# EAGLE design ESRMeterN (EAGLE 6.6.0)
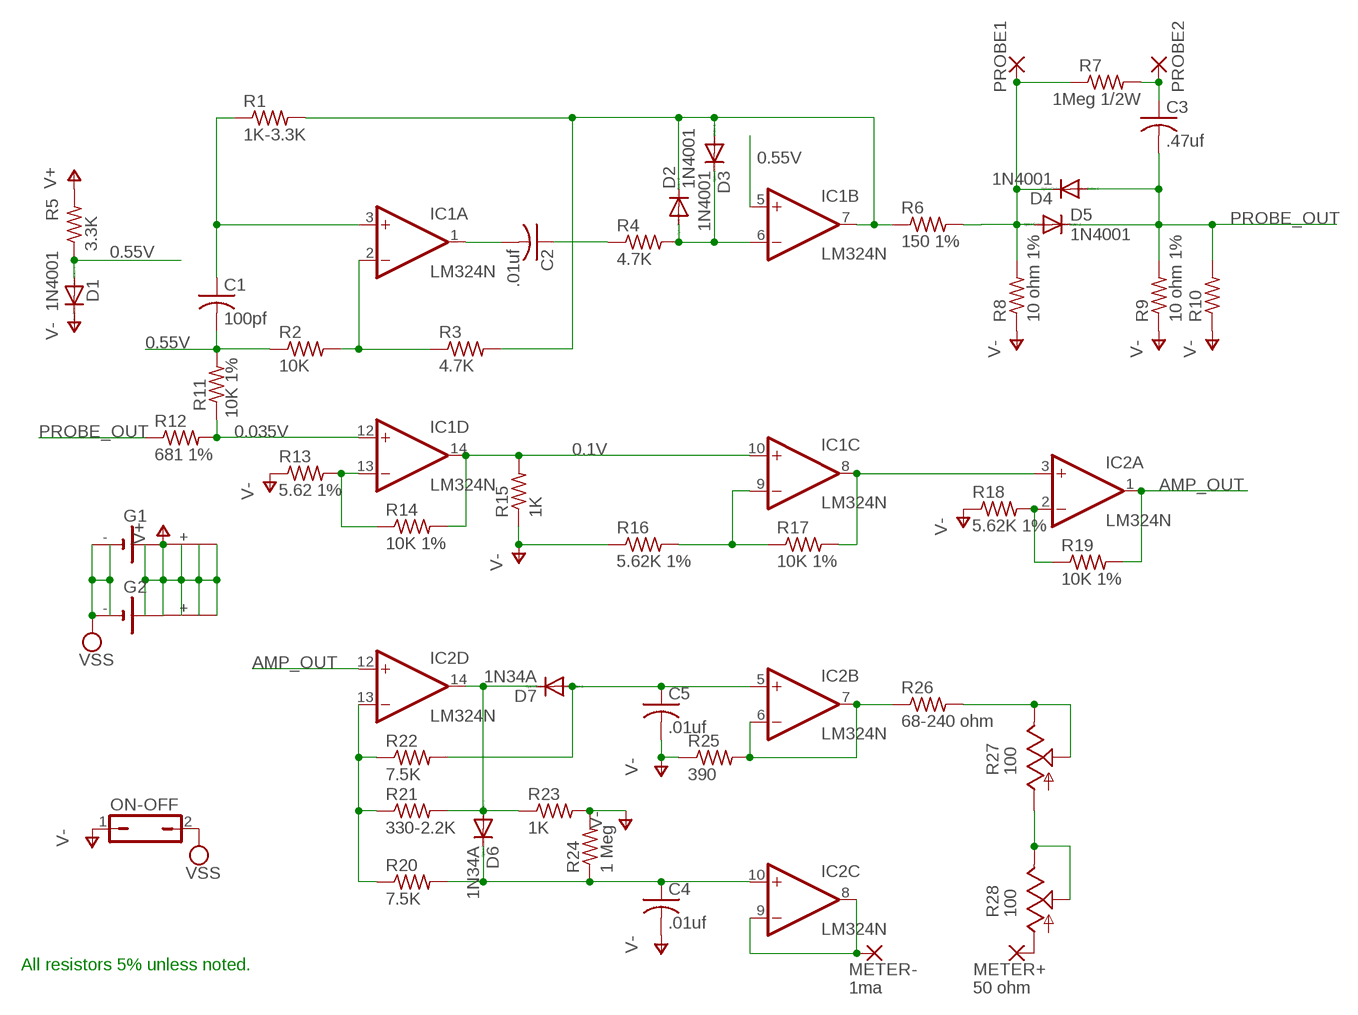
[diagram p0: schematic, sheet 1]

## Parts
C1  100pf  C-US050-025X075  [C050-025X075]
C2  .01uf  C-US050-025X075  [C050-025X075]
C3  .47uf  C-US075-032X103  [C075-032X103]
C4  .01uf  C-US050-025X075  [C050-025X075]
C5  .01uf  C-US050-025X075  [C050-025X075]
D1  1N4001  1N4004  [DO41-10]
D2  1N4001  1N4004  [DO41-10]
D3  1N4001  1N4004  [DO41-10]
D4  1N4001  1N4004  [DO41-10]
D5  1N4001  1N4004  [DO41-10]
D6  1N34A  1N4004  [DO41-10]
D7  1N34A  1N4004  [DO41-10]
G1  B2430UNI  [B2430UNI]
G2  B2430UNI  [B2430UNI]
IC1  LM324N  [DIL14]
IC2  LM324N  [DIL14]
METER+  50 ohm  2,15/1,0  [2,15/1,0]
METER-  1ma  2,15/1,0  [2,15/1,0]
ON-OFF  JP1Q  [JP1]
PROBE1  2,15/1,0  [2,15/1,0]
PROBE2  2,15/1,0  [2,15/1,0]
R1  1K-3.3K  R-US_0207/10  [0207/10]
R2  10K  R-US_0207/10  [0207/10]
R3  4.7K  R-US_0207/10  [0207/10]
R4  4.7K  R-US_0207/10  [0207/10]
R5  3.3K  R-US_0207/10  [0207/10]
R6  150 1%  R-US_0207/10  [0207/10]
R7  1Meg 1/2W  R-US_0207/12  [0207/12]
R8  10 ohm 1%  R-US_0207/10  [0207/10]
R9  10 ohm 1%  R-US_0207/10  [0207/10]
R10  R-US_0207/10  [0207/10]
R11  10K 1%  R-US_0207/10  [0207/10]
R12  681 1%  R-US_0207/10  [0207/10]
R13  5.62 1%  R-US_0207/10  [0207/10]
R14  10K 1%  R-US_0207/10  [0207/10]
R15  1K  R-US_0207/10  [0207/10]
R16  5.62K 1%  R-US_0207/10  [0207/10]
R17  10K 1%  R-US_0207/10  [0207/10]
R18  5.62K 1%  R-US_0207/10  [0207/10]
R19  10K 1%  R-US_0207/10  [0207/10]
R20  7.5K  R-US_0207/10  [0207/10]
R21  330-2.2K  R-US_0207/10  [0207/10]
R22  7.5K  R-US_0207/10  [0207/10]
R23  1K  R-US_0207/10  [0207/10]
R24  1 Meg  R-US_0207/12  [0207/12]
R25  390  R-US_0207/10  [0207/10]
R26  68-240 ohm  R-US_0207/10  [0207/10]
R27  100  TRIM_US-B64W  [B64W]
R28  100  TRIM_US-B64W  [B64W]

## Nets
0.1V: IC1.10(C:+IN) IC1.14(D:OUT) R14.2 R15.2
0.035V: IC1.12(D:+IN) R11.1 R12.2
0.55V: C1.2 D1.A IC1.5(B:+IN) R2.1 R5.1 R11.2
AMP_OUT: IC2.1(A:OUT) IC2.12(D:+IN) R19.2
N$1: D4.C D5.A PROBE1.1(P) R6.2 R7.1 R8.2
N$2: C1.1 IC1.3(A:+IN) R1.1
N$3: IC1.2(A:-IN) R2.2 R3.1
N$4: C2.2 IC1.1(A:OUT)
N$5: D2.C D3.A IC1.7(B:OUT) R1.2 R3.2 R6.1
N$6: C2.1 R4.1
N$7: C3.1 PROBE2.1(P) R7.2
N$8: D2.A D3.C IC1.6(B:-IN) R4.2
N$9: IC2.2(A:-IN) R18.2 R19.1
N$10: IC1.13(D:-IN) R13.2 R14.1
N$11: C5.1 D7.A IC2.5(B:+IN) R22.2
N$12: IC1.8(C:OUT) IC2.3(A:+IN) R17.2
N$13: IC1.9(C:-IN) R16.2 R17.1
N$14: IC2.13(D:-IN) R20.1 R21.1 R22.1
N$15: D6.A D7.C IC2.14(D:OUT) R21.2 R23.1
N$16: C4.1 D6.C IC2.10(C:+IN) R20.2 R24.1
N$17: IC2.6(B:-IN) IC2.7(B:OUT) R25.2 R26.1
N$18: IC2.8(C:OUT) IC2.9(C:-IN) METER-.1(P)
N$19: R26.2 R27.E R27.S
N$20: R27.A R28.E R28.S
N$21: METER+.1(P) R28.A
PROBE_OUT: C3.2 D4.A D5.C R9.2 R10.2 R12.1
V+: G1.+ G1.+@1(+) G1.+@2(+) G1.+@3(+) G1.+@4(+) G2.+ G2.+@1(+) G2.+@2(+) G2.+@3(+) G2.+@4(+) R5.2
V-: C4.2 C5.2 D1.C ON-OFF.1 R8.1 R9.1 R10.1 R13.1 R15.1 R16.1 R18.1 R23.2 R24.2 R25.1
VSS: G1.- G1.-@1(-) G2.- G2.-@1(-) ON-OFF.2

## Notes on the sheet
- All resistors 5% unless noted.

## Power pins joined to a net without a drawn wire
V+: IC1.4(P:V+) IC2.4(P:V+)
V-: IC1.11(P:V-) IC2.11(P:V-)

## Library data of the parts
C1-C5 = rcl:C-US: CAPACITOR, American symbol
D1-D7 = diode:1N4004: DIODE general purpose rectifier, 1 A
G1 G2 = battery:B2430UNI: LI BATTERY
IC1 IC2 = linear:LM324: OP AMP
METER+ METER- PROBE1 PROBE2 = wirepad:2,15/1,0: THROUGH-HOLE PAD
ON-OFF = jumper:JP1Q: JUMPER
R1-R26 = rcl:R-US_: RESISTOR, American symbol
R27 R28 = pot:TRIM_US-: POTENTIOMETER

## Board
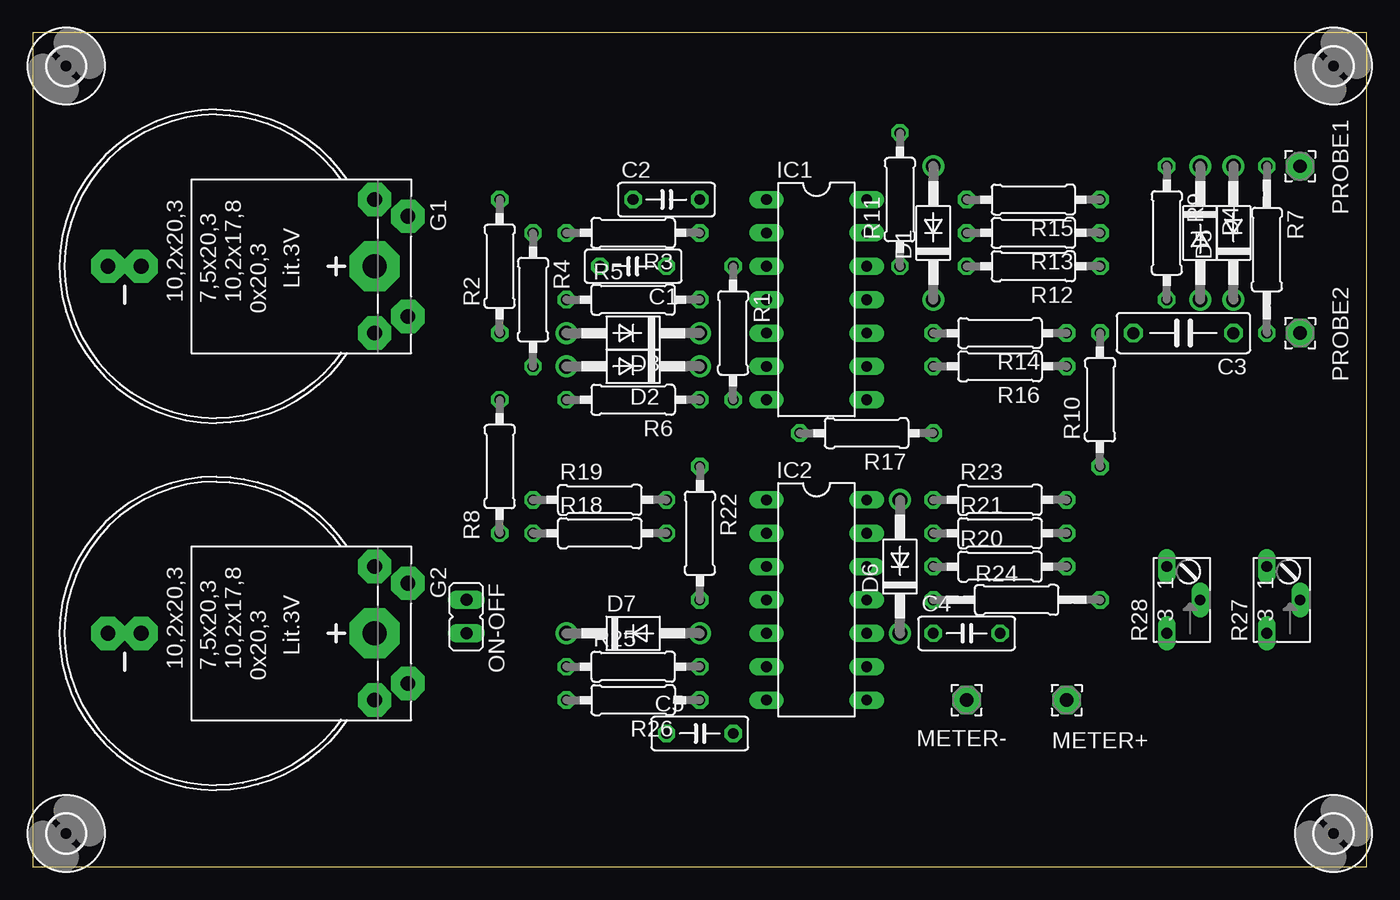
[diagram p1: board, top side]
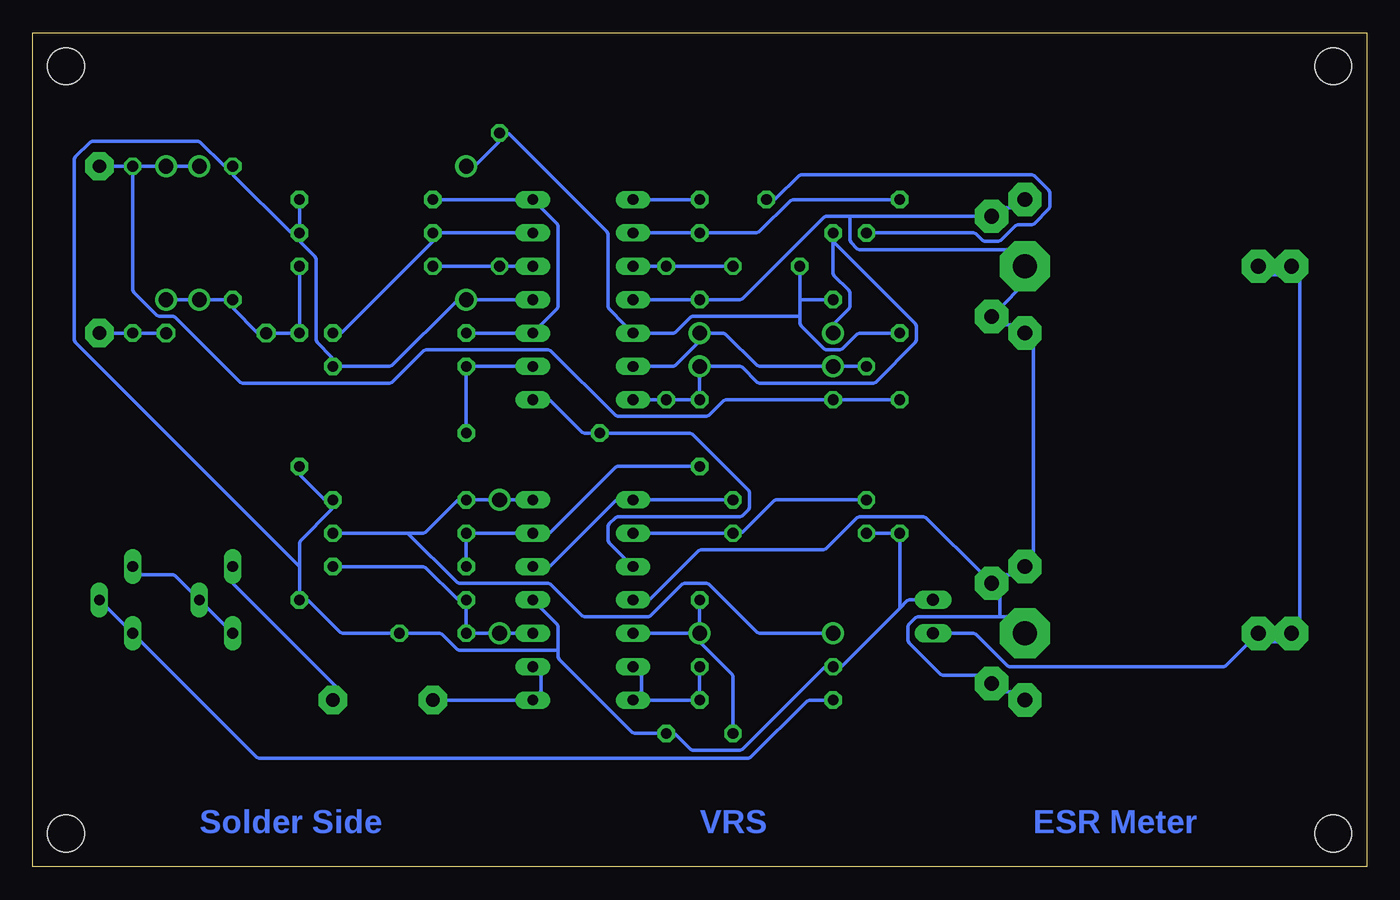
[diagram p2: board, bottom side, seen from below]

Size 101.58 x 63.49 mm. Coordinates in mm from the lower left corner, seen from the top.
Outline: 0,0 101.58,0 101.58,63.49 0,63.49 0,0
Copper layers (1*16): Top 0.035mm / dielectric 1.5mm / Bottom 0.035mm
Design rules "10mils": minimum track width 10mil, minimum drill 24mil, track to track 15mil, track to pad 10mil, pad to pad 10mil, via to via 10mil, smd to smd 10mil, copper to edge 40mil, drill to drill 10mil, minimum pad ring 10mil, minimum via ring 8mil, stop-mask expansion 0mil, vias tented up to drill 0mil, thermal gap 10mil

### Footprints (pad centres in the part's own frame; a part is rotated, then mirrored left to right if it is on the bottom)
C050-025X075 = drill 0.813 octagon: 1 -2.54,0; 2 2.54,0
C075-032X103 = drill 0.914 octagon: 1 -3.81,0; 2 3.81,0
DO41-10 = drill 1.118: A 5.08,0; C -5.08,0
B2430UNI = drill 1.118 pad 2.54 octagon: + 3.81,14.605; +@1 -3.81,14.605; +@2 -5.08,12.065; +@3 5.08,12.065; - 0,-5.715; -@1 0,-8.255 | drill 1.803 pad 3.81 octagon: +@4 0,12.065
DIL14 = drill 0.813 long: 1 -7.62,-3.81; 2 -5.08,-3.81; 3 -2.54,-3.81; 4 0,-3.81; 5 2.54,-3.81; 6 5.08,-3.81; 7 7.62,-3.81; 8 7.62,3.81; 9 5.08,3.81; 10 2.54,3.81; 11 0,3.81; 12 -2.54,3.81; 13 -5.08,3.81; 14 -7.62,3.81
2,15/1,0 = drill 1.016 pad 2.159 octagon: 1 0,0
JP1 = drill 0.914 long: 1 0,-1.27; 2 0,1.27
0207/10 = drill 0.813 octagon: 1 -5.08,0; 2 5.08,0
0207/12 = drill 0.813 octagon: 1 -6.35,0; 2 6.35,0
B64W = drill 0.813 long: A 2.54,0; E -2.54,0; S 0,-2.54
2,8 = hole 2.8: 0,0

### Placement (x,y rotation side)
C1  45.71,45.71 180 top
C2  48.25,50.79 0 top
C3  87.62,40.63 180 top
C4  71.12,17.77 0 top
C5  50.79,10.15 0 top
D1  68.58,48.25 90 top
D2  45.71,38.09 180 top
D3  45.71,40.63 180 top
D4  88.9,48.25 270 top
D5  91.44,48.25 90 top
D6  66.04,22.85 90 top
D7  45.71,17.77 0 top
G1  13.96,45.71 270 top
G2  13.96,17.77 270 top
IC1  59.68,43.17 270 top
IC2  59.68,20.31 270 top
METER+  78.73,12.69 90 top
METER-  71.12,12.69 90 top
ON-OFF  33.02,19.04 180 top
PROBE1  96.52,53.33 90 top
PROBE2  96.52,40.63 90 top
R1  53.34,40.63 270 top
R2  35.55,45.71 90 top
R3  45.71,48.25 180 top
R4  38.09,43.17 270 top
R5  45.71,43.17 0 top
R6  45.71,35.55 180 top
R7  93.98,46.98 270 top
R8  35.55,30.47 90 top
R9  86.36,48.25 270 top
R10  81.28,35.55 90 top
R11  66.04,50.79 90 top
R12  76.2,45.71 180 top
R13  76.2,48.25 180 top
R14  73.66,40.63 180 top
R15  76.2,50.79 180 top
R16  73.66,38.09 180 top
R17  63.49,33.01 180 top
R18  43.17,25.39 0 top
R19  43.17,27.93 0 top
R20  73.66,22.85 0 top
R21  73.66,25.39 0 top
R22  50.79,25.39 270 top
R23  73.66,27.93 0 top
R24  74.93,20.31 0 top
R25  45.71,15.23 0 top
R26  45.71,12.69 180 top
R27  93.98,20.31 90 top
R28  86.36,20.31 90 top
U$1  [2,8]  2.54,60.95 0 top
U$2  [2,8]  2.54,2.53 0 top
U$3  [2,8]  99.06,2.53 0 top
U$4  [2,8]  99.06,60.95 0 top

### Tracks (layer width: path | path; a pad name or v marks a point on that pad's centre or on a via)
0.1V
  Bottom 0.254: R14.2 67.94,40.63 64.77,40.63 IC1.10 62.86,41.27 61.66,42.46 61.59,42.64 61.59,48.78 61.66,48.96 62.86,50.16 IC1.14 64.77,50.79 70.48,50.79 R15.2
0.035V
  Bottom 0.254: IC1.12 64.77,45.71 65.4,45.71 R11.1 66.67,45.71 70.48,45.71 R12.2
0.55V
  Bottom 0.254: D1.A 68.05,53.33 67.87,53.41 66.11,55.16 66.04,55.34 R11.2 65.51,55.87 65.33,55.8 57.85,48.33 57.78,48.15 57.78,42.64 57.71,42.46 56.51,41.27 IC1.5 54.6,40.63 52.8,40.63 52.63,40.71 51.5,41.83 51.32,41.9 43.17,41.9 | 43.17,43.17 43.17,45.08 C1.2 | 43.17,41.9 43.17,43.17 | 43.17,41.9 43.17,41.37 43.1,41.19 41.34,39.44 41.16,39.36 40.1,39.36 39.93,39.44 38.8,40.56 38.62,40.63 36.19,40.63 R2.1 | 43.17,43.17 41.27,43.17 R5.1
AMP_OUT
  Bottom 0.254: R19.2 48.89,27.93 54.6,27.93 IC2.1 57.04,27.93 57.22,27.86 62.15,22.93 62.33,22.85 IC2.12
N$1
  Bottom 0.254: R8.2 36.19,35.55 40,35.55 R6.2 41.27,35.55 48.78,35.55 48.96,35.48 50.09,34.36 50.27,34.28 57.04,34.28 57.22,34.36 62.15,39.29 62.33,39.36 71.65,39.36 71.82,39.29 74.22,36.9 74.4,36.82 85.62,36.82 85.79,36.9 90.73,41.83 90.91,41.9 91.97,41.9 92.14,41.98 93.9,43.73 93.98,43.91 93.98,52.7 R7.1 | R7.1 93.34,53.33 92.07,53.33 D5.A 90.8,53.33 89.53,53.33 D4.C | PROBE1.1 95.88,53.33 94.61,53.33 R7.1
N$2
  Bottom 0.254: C1.1 48.89,45.71 52.7,45.71 R1.1 53.97,45.71 54.6,45.71 IC1.3
N$3
  Bottom 0.254: R2.2 36.19,50.79 43.7,50.79 43.88,50.72 46.28,48.33 46.45,48.25 50.16,48.25 R3.1 51.43,48.25 54.6,48.25 IC1.2
N$4
  Bottom 0.254: C2.2 51.43,50.79 54.6,50.79 IC1.1
N$5
  Bottom 0.254: IC1.7 54.6,35.55 53.97,35.55 R1.2 52.7,35.55 51.43,35.55 R6.1 50.79,36.19 50.79,37.46 D2.C 50.16,38.09 47.72,38.09 47.55,38.02 46.42,36.9 46.24,36.82 37.56,36.82 37.39,36.9 34.36,39.92 34.28,40.1 34.28,41.16 34.36,41.34 40.63,47.62 | 40.63,47.62 40.63,45.18 40.56,45 39.44,43.88 39.36,43.7 39.36,42.64 39.44,42.46 40.56,41.34 40.63,41.16 D3.A | 40.63,47.62 R3.2 40.63,47.62
N$6
  Bottom 0.254: R4.1 37.46,48.25 29.95,48.25 29.77,48.18 29.28,47.69 29.1,47.62 28.04,47.62 27.86,47.69 26.74,48.81 26.56,48.89 25.5,48.89 25.32,48.96 24.2,50.08 24.12,50.26 24.12,51.32 24.2,51.5 25.32,52.62 25.5,52.7 43.07,52.7 43.25,52.62 45.01,50.87 45.18,50.79 C2.1
N$7
  Bottom 0.254: C3.1 92.07,40.63 93.34,40.63 R7.2 94.61,40.63 95.88,40.63 PROBE2.1
N$8
  Bottom 0.254: R4.2 38.73,38.09 40,38.09 D2.A 41.27,38.09 46.24,38.09 46.42,38.17 48.82,40.56 48.99,40.63 50.16,40.63 D3.C 50.79,40.1 50.87,39.92 52.63,38.17 52.8,38.09 54.6,38.09 IC1.6
N$9
  Bottom 0.254: IC2.2 54.6,25.39 48.89,25.39 R18.2 47.72,25.39 47.55,25.47 45.15,27.86 44.97,27.93 38.73,27.93 R19.1
N$10
  Bottom 0.254: IC1.13 64.77,48.25 70.48,48.25 R13.2 71.12,47.72 71.19,47.54 78.03,40.71 78.2,40.63 R14.1
N$11
  Bottom 0.254: C5.1 48.25,10.79 48.25,14.49 48.33,14.67 50.72,17.06 50.79,17.24 D7.A | R22.2 50.79,19.68 50.79,18.41 D7.A | IC2.5 54.6,17.77 51.43,17.77 D7.A
N$12
  Bottom 0.254: IC2.3 56.51,23.49 57.71,24.68 57.78,24.86 57.78,25.92 57.71,26.1 57.22,26.59 57.04,26.66 47.72,26.66 47.55,26.74 47.06,27.22 46.98,27.4 46.98,28.46 47.06,28.64 51.36,32.94 51.53,33.01 57.78,33.01 R17.2 59.05,33.01 59.58,33.01 59.76,33.09 62.15,35.48 62.33,35.55 IC1.8
N$13
  Bottom 0.254: R17.1 68.58,33.65 68.58,37.46 R16.2 67.94,38.09 64.77,38.09 IC1.9
N$14
  Bottom 0.254: R22.1 51.43,30.47 57.04,30.47 57.22,30.4 62.15,25.47 62.33,25.39 IC2.13 64.77,25.39 67.94,25.39 R21.1 68.58,24.76 68.58,23.49 R20.1
N$15
  Bottom 0.254: IC2.14 64.77,27.93 65.4,27.93 D6.A 66.67,27.93 67.94,27.93 R23.1 69.11,27.93 69.28,27.86 71.68,25.47 71.86,25.39 73.02,25.39 | 73.02,25.39 78.1,25.39 R21.2 | 73.02,25.39 69.28,21.66 69.11,21.58 62.33,21.58 62.15,21.51 59.76,19.12 59.58,19.04 54.71,19.04 54.53,19.12 52.14,21.51 51.96,21.58 50.27,21.58 50.09,21.51 46.42,17.85 46.24,17.77 41.27,17.77 D7.C
N$16
  Bottom 0.254: IC2.10 64.77,17.77 65.4,17.77 D6.C 66.67,17.77 67.94,17.77 C4.1 68.58,18.41 68.58,19.68 R24.1 69.11,20.31 69.28,20.39 71.68,22.78 71.86,22.85 78.1,22.85 R20.2
N$17
  Bottom 0.254: R25.2 50.79,14.6 50.79,13.33 R26.1 51.43,12.69 54.6,12.69 IC2.7 55.31,13.25 55.24,13.43 55.24,14.49 55.31,14.67 IC2.6
N$18
  Bottom 0.254: IC2.9 62.93,14.67 62.86,14.49 62.86,13.43 62.93,13.25 IC2.8 64.77,12.69 70.48,12.69 METER-.1
N$19
  Bottom 0.254: R26.2 41.27,12.69 42.43,12.69 42.61,12.62 46.91,8.32 47.09,8.25 84.34,8.25 84.52,8.32 93.34,17.14 R27.E 94.61,18.41 95.88,19.68 R27.S
N$20
  Bottom 0.254: R28.E 86.99,18.41 88.26,19.68 R28.S 89.53,20.95 90.73,22.14 90.91,22.22 93.23,22.22 93.41,22.29 R27.A
N$21
  Bottom 0.254: R28.A 86.36,21.69 86.28,21.51 78.28,13.51 78.28,13.15 METER+.1
PROBE_OUT
  Bottom 0.254: D5.C 90.8,43.17 89.53,43.17 D4.A 88.26,43.17 86.99,43.17 R9.2 86.36,42.64 86.28,42.46 84.52,40.71 84.34,40.63 C3.2 83.18,40.63 81.91,40.63 R10.2 81.28,41.27 81.28,45.08 R12.1
V+
  Bottom 0.254: IC1.4 54.6,43.17 51.43,43.17 R5.2 50.16,43.17 47.72,43.17 47.55,43.25 41.34,49.45 41.16,49.52 39.36,49.52 | 39.36,49.52 29.21,49.52 G1.+@1 28.01,50.08 27.83,50.16 26.77,50.16 26.59,50.23 G1.+@2 | G2.+@3 26.59,13.25 26.77,13.33 27.83,13.33 28.01,13.4 G2.+ 29.13,14.52 29.31,14.6 32.27,14.6 32.45,14.67 34.85,17.06 34.92,17.24 34.92,18.3 34.85,18.48 34.36,18.97 34.18,19.04 27.94,19.04 | 27.94,19.04 27.41,19.04 27.23,18.97 G2.+@4 | IC2.4 54.71,20.31 54.53,20.39 50.87,24.05 50.69,24.12 41.38,24.12 41.2,24.2 38.8,26.59 38.62,26.66 33.75,26.66 33.58,26.59 29.21,22.22 G2.+@1 | G2.+@1 28.01,22.14 27.83,22.22 26.77,22.22 26.59,22.29 G2.+@2 25.47,23.41 25.39,23.59 25.39,39.89 25.47,40.07 G1.+@3 26.59,41.19 26.77,41.27 27.83,41.27 28.01,41.34 G1.+ 27.94,42.54 26.1,44.37 26.03,44.55 G1.+@4 27.23,46.91 27.41,46.98 38.62,46.98 38.8,47.06 39.29,47.54 39.36,47.72 39.36,49.52 | 27.94,19.04 27.94,20.84 28.01,21.02 G2.+@1
V-
  Bottom 0.254: R13.1 81.28,48.89 81.28,50.16 R15.1 | R13.1 81.81,48.25 81.98,48.33 86.28,52.62 86.36,52.8 R9.1 86.89,53.33 87.06,53.41 88.82,55.16 89,55.24 97.05,55.24 97.22,55.16 98.35,54.04 98.42,53.86 98.42,40.1 98.35,39.92 81.28,22.85 | IC1.11 64.77,43.17 67.94,43.17 D1.C 69.11,43.17 69.28,43.1 74.22,38.17 74.4,38.09 78.1,38.09 R16.1 78.73,38.62 78.81,38.8 79.93,39.92 80.01,40.1 80.01,46.24 80.08,46.42 81.2,47.54 81.28,47.72 R13.1 | R10.1 81.28,29.94 81.2,29.76 79.44,28.01 79.27,27.93 R23.2 78.73,27.4 78.81,27.22 81.2,24.83 81.28,24.65 81.28,22.85 | 81.28,22.85 81.28,20.95 R24.2 80.75,20.31 80.57,20.24 78.17,17.85 78,17.77 74.29,17.77 C4.2 73.02,17.77 70.59,17.77 70.41,17.7 69.28,16.58 69.11,16.5 61.59,16.5 | R18.1 37.46,25.39 36.19,25.39 R8.1 35.55,24.76 35.55,19.68 | 35.55,19.68 34.99,20.24 34.81,20.31 34.28,20.31 ON-OFF.1 | 35.55,19.68 39.93,15.31 40.1,15.23 R25.1 41.16,15.23 41.34,15.16 47.55,8.96 47.72,8.88 51.32,8.88 51.5,8.96 52.63,10.08 52.8,10.15 C5.2 53.97,10.15 55.77,10.15 55.95,10.23 61.52,15.79 61.59,15.97 61.59,16.5 | 61.59,16.5 61.59,18.3 61.66,18.48 62.86,19.68 IC2.11
VSS
  Bottom 0.254: G1.- 7.69,45.15 7.51,45.08 6.45,45.08 6.27,45.15 G1.-@1 5.15,45.15 5.08,44.97 5.08,18.51 5.15,18.33 G2.-@1 6.27,17.21 6.45,17.14 7.51,17.14 7.69,17.21 G2.- 8.88,17.14 10.72,15.31 10.89,15.23 27.2,15.23 27.37,15.31 29.77,17.7 29.95,17.77 31.75,17.77 ON-OFF.2

### Text on the board
Bottom: ESR Meter | VRS | Solder Side